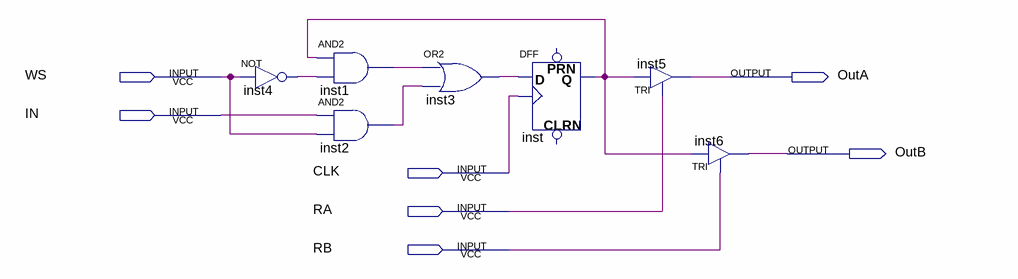
[diagram p0: schematic sheet]
// Quartus schematic RFC.bdf as structural Verilog: 7 symbols, 7 pins
module RFC (
  input  WS,
  input  IN,
  input  CLK,
  input  RA,
  input  RB,
  output OutA,
  output OutB
);

  wire inst1_out, inst2_out, inst3_out, inst4_out, inst_q;

  not inst4 (inst4_out, WS);
  and inst1 (inst1_out, inst_q, inst4_out);
  and inst2 (inst2_out, IN, WS);
  or inst3 (inst3_out, inst1_out, inst2_out);
  DFF inst (.CLK(CLK), .D(inst3_out), .Q(inst_q));  // open: CLRN, PRN
  TRI inst5 (.IN(inst_q), .OE(RA), .OUT(OutA));
  TRI inst6 (.IN(inst_q), .OE(RB), .OUT(OutB));
endmodule
